# EAGLE design Hall Effect Sensor 63mm (EAGLE 7.2.0)
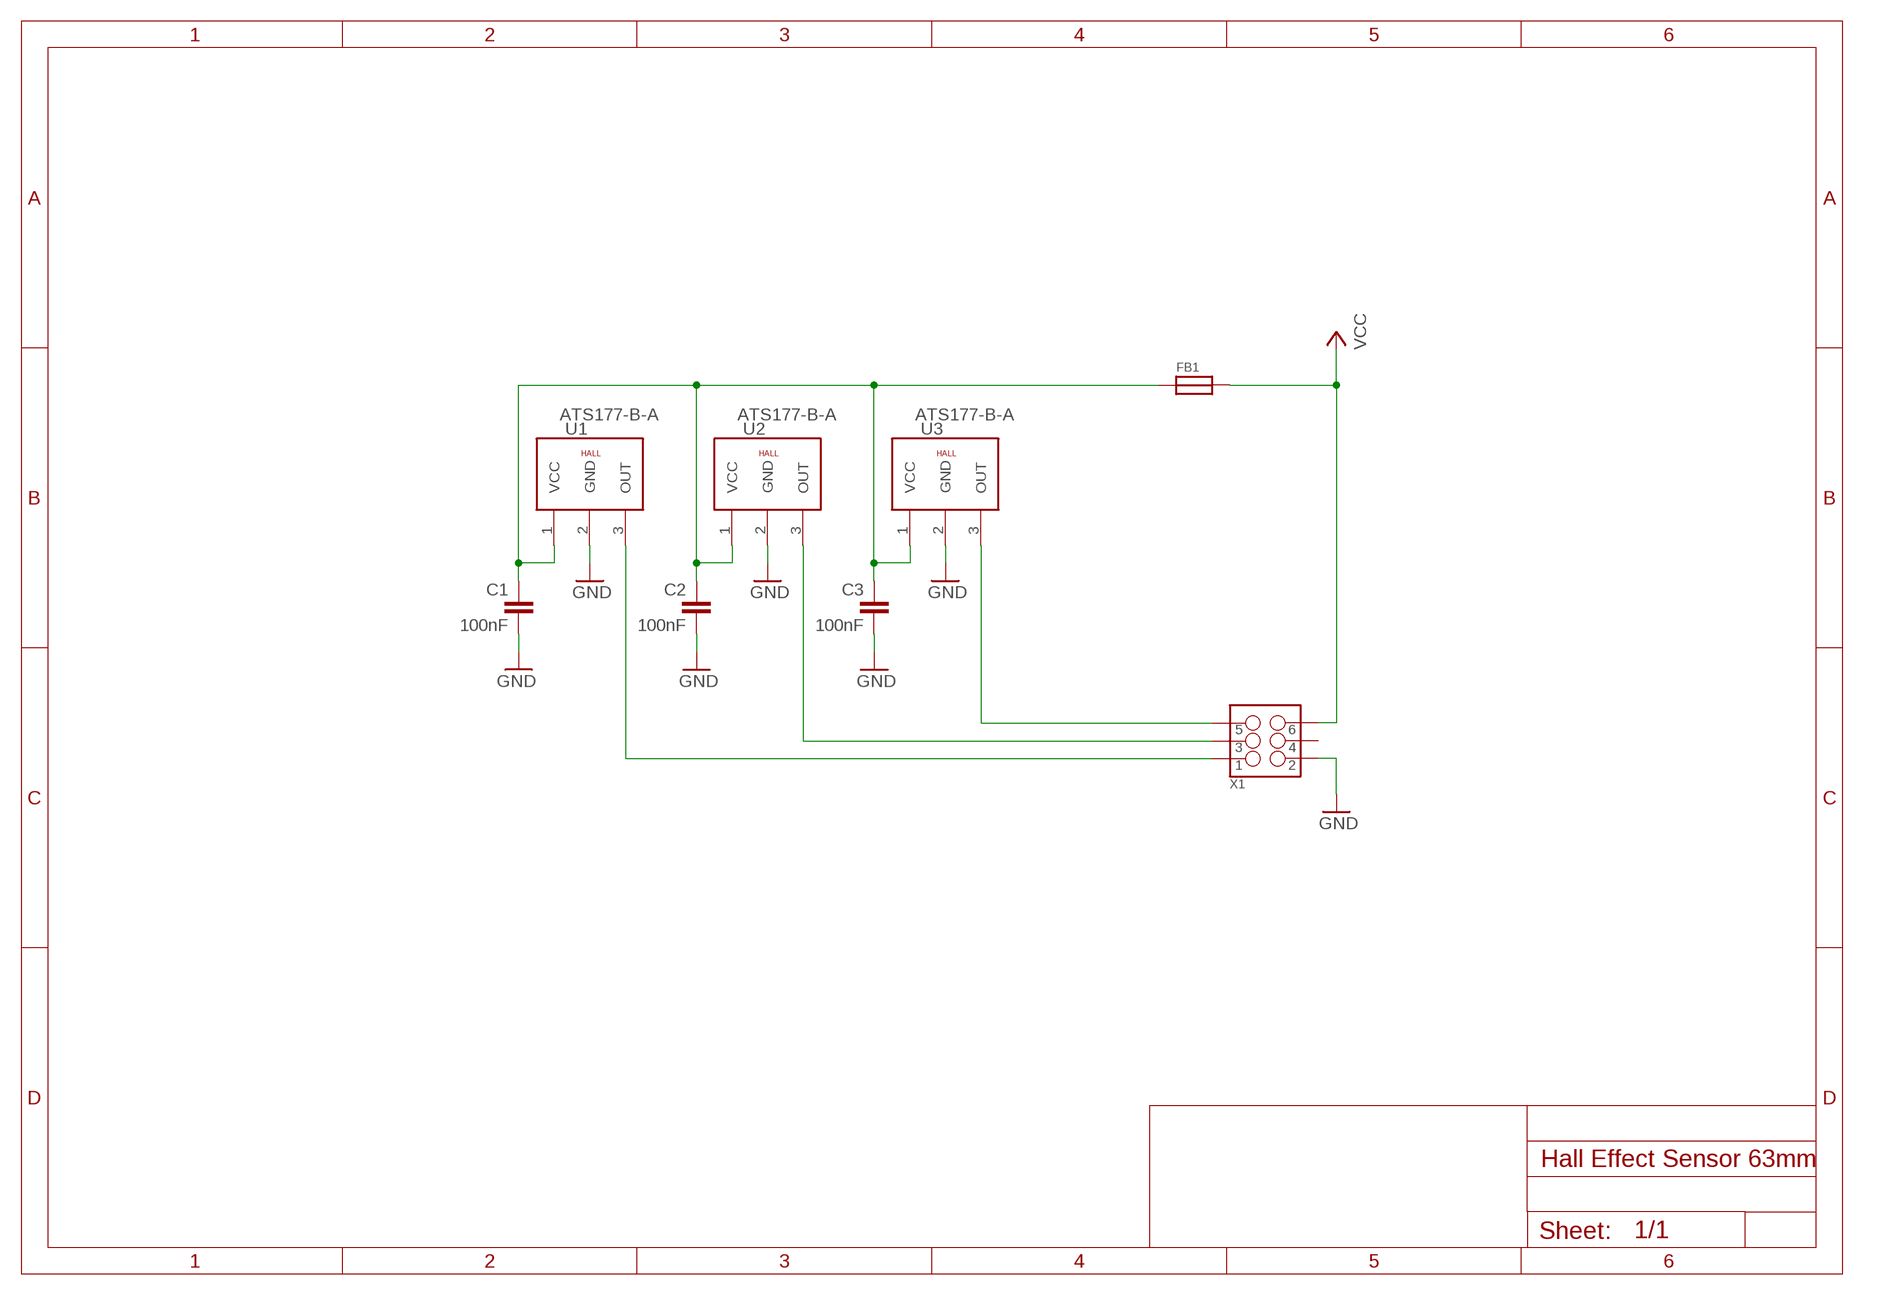
[diagram p0: schematic, sheet 1]

## Parts
C1  100nF  C-EUC0603  [C0603]
C2  100nF  C-EUC0603  [C0603]
C3  100nF  C-EUC0603  [C0603]
FB1  FERRITE  [0603]
U1  ATS177-B-A  HALL3-SIP  [3PINS1,27]
U2  ATS177-B-A  HALL3-SIP  [3PINS1,27]
U3  ATS177-B-A  HALL3-SIP  [3PINS1,27]
X1  M03X2POGO_PINS  [2X3_POGO]

## Nets
GND: C1.2 C2.2 C3.2 U1.2(GND) U2.2(GND) U3.2(GND) X1.P$2
OUT1: U1.3(OUT) X1.P$1
OUT2: U2.3(OUT) X1.P$3
OUT3: U3.3(OUT) X1.P$5
VCC: FB1.2 X1.P$6
VDD: C1.1 C2.1 C3.1 FB1.1 U1.1(VCC) U2.1(VCC) U3.1(VCC)
Unconnected: X1.P$4

## Library data of the parts
C1-C3 = rcl:C-EU: CAPACITOR, European symbol; MF: TDK; MPN: CGA3E2X7R1H104K080AA; OC_FARNELL: 2346967
FB1 = microbuilder:FERRITE: Ferrite Bead 0603 MMZ1608B121C - 120 Ohm, 600mA Ferrite Chip - Digikey: 445-2164-1-ND BK1608HW121-T - 120 Ohm, 600mA Ferrite Chip - Digikey: 587-1876-2-ND; MF: MURATA; MPN: BLM18TG601TN1D; OC_FARNELL: 1115050
U1-U3 = charleses_parts_bin:HALL; MF: ALLEGRO MICROSYSTEMS; MPN: A1221LUA-T; OC_FARNELL: 1791408
X1 = SparkFun-Connectors:M03X2: 2x3 .1" header. Shrouded, with keying- CONN-10681 SMT- CONN-11415 Pogo pins- HW-11044; OC_FARNELL: unknown; PROD_ID: HW-11044

## Board
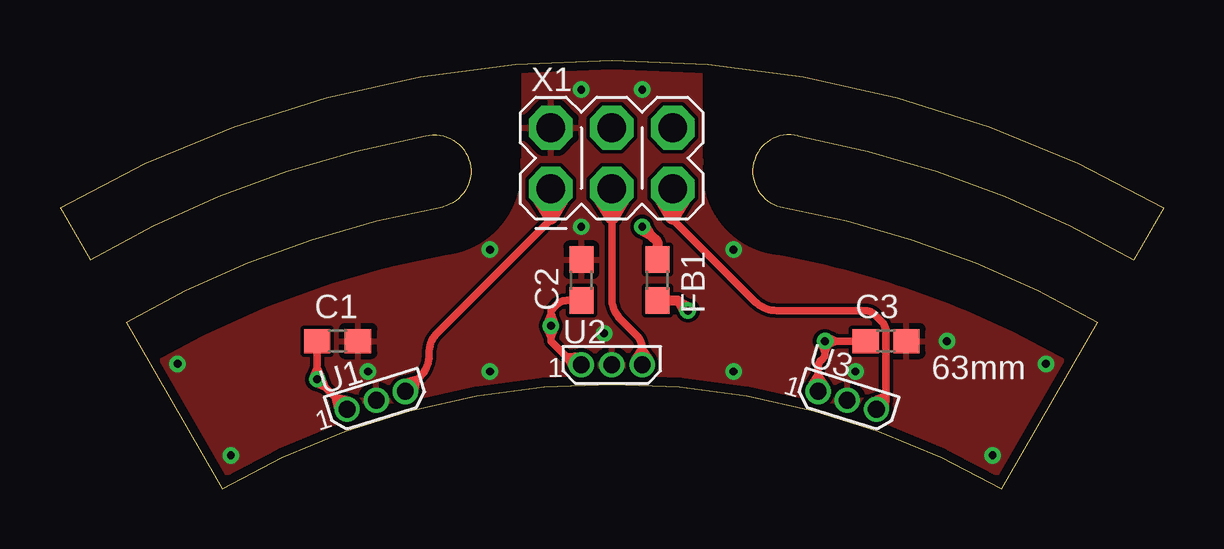
[diagram p1: board, top side]
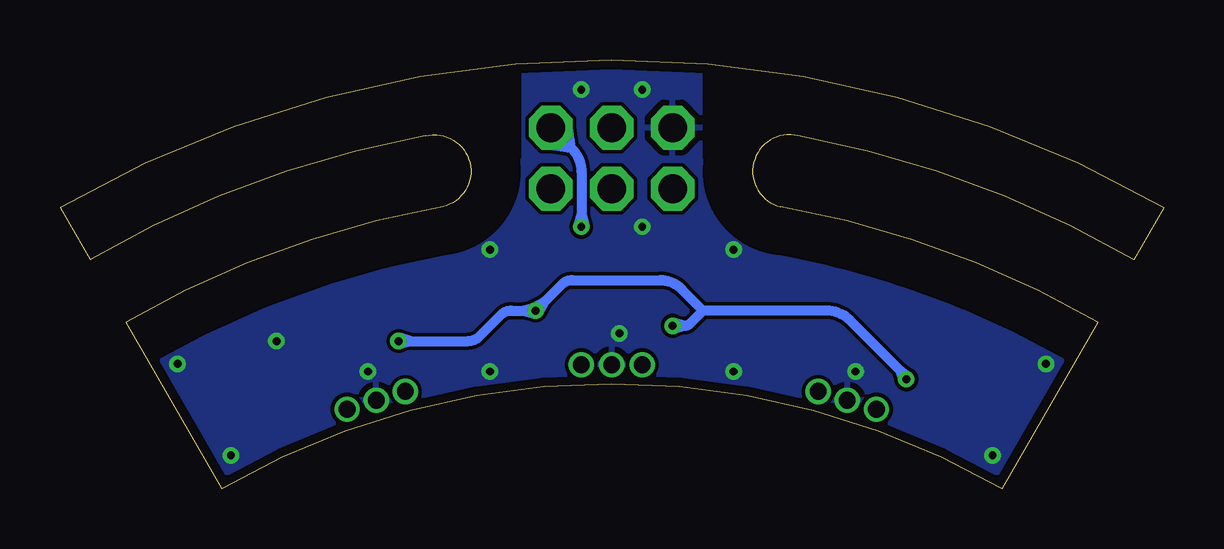
[diagram p2: board, bottom side, seen from below]

Size 46 x 17.85 mm. Coordinates in mm from the lower left corner, seen from the top.
Outline: 6.75,0 arc-60 39.25,0 43.25,6.93 arc20 30.03,11.74 arc-180 30.75,14.69 arc-20 44.75,9.53 46,11.69 arc60 0,11.69 1.25,9.53 arc-20 15.25,14.69 arc-180 15.97,11.74 arc20 2.75,6.93 6.75,0
Copper layers (1*16): Top 0.0356mm / dielectric 1.5011mm / Bottom 0.0356mm
Design rules "OSHPark-2layer": minimum track width 6mil, minimum drill 13mil, track to track 6mil, track to pad 6mil, pad to pad 6mil, via to via 6mil, smd to smd 6mil, copper to edge 15mil, drill to drill 6mil, minimum pad ring 7mil, minimum via ring 7mil, stop-mask expansion 3mil, vias tented up to drill 0mil, thermal gap 10mil
tRestrict: 4 lines
bRestrict: 4 lines

### Footprints (pad centres in the part's own frame; a part is rotated, then mirrored left to right if it is on the bottom)
C0603 = smd 1.1 x 1: 1 -0.85,0; 2 0.85,0
0603 = smd 1.1 x 1: 1 -0.85,0; 2 0.85,0
3PINS1,27 = drill 0.7 pad 1.016: 1 -1.27,0; 2 0,0; 3 1.27,0
2X3_POGO = drill 1.2 pad 1.829 octagon: P$1 0,0; P$2 0,2.54; P$3 2.54,0; P$4 2.54,2.54; P$5 5.08,0; P$6 5.08,2.54

### Placement (x,y rotation side)
C1  11.57,6.14 0 top
C2  21.73,8.68 90 top
C3  34.43,6.14 0 top
FB1  24.91,8.68 90 top
U1  13.18,3.67 17.1 top
U2  23,5.15 0 top
U3  32.82,3.67 342.9 top
X1  20.46,12.49 0 top

### Tracks (layer width: path | path; a pad name or v marks a point on that pad's centre or on a via)
GND  (via drill 0.33)
  other vias: 4.9,5.19 7.12,1.38 38.88,1.38 41.1,5.19 17.92,9.95 21.73,16.62 24.27,16.62 28.08,9.95 17.92,4.87 28.08,4.87 36.97,6.14 33.16,4.87 22.68,6.46 12.84,4.87 21.73,10.91
  pour Top (rank 6): -1.13,18.84 47.13,18.84 47.13,-1.48 -1.13,-1.48
  pour Bottom (rank 6): -1.13,18.84 47.13,18.84 47.13,-1.48 -1.13,-1.48
OUT1
  Top 0.305: X1.P$1 20.46,11.29 20.46,11.22 15.75,6.52 arc45 15.38,5.62 15.38,5.56 arc-45 15,4.66 14.89,4.54 | U1.3 14.89,4.54 | 14.89,4.54 14.32,4.41 U1.3 | 14.89,4.54 14.77,3.97 U1.3
  Top 0.61: 20.46,11.29 20.98,12.18 X1.P$1 19.93,12.18 20.46,11.29
OUT2
  Top 0.305: X1.P$3 23,11.29 23,7.94 arc45 23.37,7.04 24.07,6.35 arc-45 24.27,5.85 | U2.3 24.27,5.85 | 24.27,5.85 23.95,5.36 U2.3 | 24.27,5.85 24.59,5.36 U2.3
  Top 0.61: 23,11.29 23.52,12.18 X1.P$3 22.48,12.18 23,11.29
OUT3
  Top 0.305: X1.P$5 25.54,11.29 25.54,11.22 28.98,7.79 arc45 29.88,7.41 33.53,7.41 arc-45 33.98,7.23 34.24,6.97 arc-45 34.43,6.52 34.43,3.88 | U3.3 34.43,3.7 34.43,3.88 | 34.43,3.88 33.88,3.65 U3.3 | 34.43,3.88 34.4,3.29 U3.3
  Top 0.61: 25.54,11.29 26.07,12.18 X1.P$5 25.02,12.18 25.54,11.29
VCC  (via drill 0.33)
  Top 0.406: v24.27,10.91 24.62,10.56 | 24.62,10.56 24.91,10.27 FB1.2 | 24.62,10.56 24.39,10.97 v24.27,10.91 | 24.62,10.56 24.2,10.78 v24.27,10.91
  Bottom 0.406: X1.P$6 24.69,14.19 | 24.69,14.19 24.64,14.14 arc45 24.27,13.24 24.27,11.4 | 24.27,11.4 v24.27,10.91 | 24.27,11.4 24.14,10.95 v24.27,10.91 | 24.27,11.4 24.4,10.95 v24.27,10.91 | 24.69,14.19 25.65,14.33 X1.P$6 | 24.69,14.19 24.84,15.14 X1.P$6
VDD  (via drill 0.33)
  Top 0.305: C3.1 32.38,6.14 | 32.38,6.14 v31.89,6.14 | U3.1 31.6,4.75 | 31.6,4.75 31.6,5.03 arc-45 31.73,5.35 31.89,5.51 31.89,5.65 | 31.89,5.65 v31.89,6.14 | U2.1 21.45,5.15 21.11,5.49 | 21.11,5.49 20.46,6.14 20.46,6.28 | 20.46,6.28 v20.46,6.78 | v20.46,6.78 20.46,7.27 | 20.46,7.27 20.46,7.41 20.71,7.66 arc-45 21.13,7.83 C2.1 | U1.1 11.48,3.8 | 11.48,3.8 11.07,4.2 | 11.07,4.2 v10.72,4.55 | C1.1 10.72,5.05 | 10.72,5.05 v10.72,4.55 | 32.38,6.14 31.96,6.32 v31.89,6.14 | 32.38,6.14 31.96,5.97 v31.89,6.14 | 31.89,5.65 32.07,6.07 v31.89,6.14 | 31.89,5.65 31.71,6.07 v31.89,6.14 | 20.46,6.28 20.64,6.71 v20.46,6.78 | 20.46,6.28 20.28,6.71 v20.46,6.78 | 20.46,7.27 20.28,6.85 v20.46,6.78 | 20.46,7.27 20.64,6.85 v20.46,6.78 | 11.07,4.2 10.9,4.62 v10.72,4.55 | 11.07,4.2 10.65,4.38 v10.72,4.55 | 10.72,5.05 10.54,4.63 v10.72,4.55 | 10.72,5.05 10.9,4.63 v10.72,4.55 | 11.48,3.8 11.6,3.22 U1.1 | 11.48,3.8 12.05,3.67 U1.1 | 21.11,5.49 21.4,4.97 U2.1 | 21.11,5.49 21.7,5.53 U2.1 | 31.6,4.75 31.29,4.25 U3.1 | 31.6,4.75 31.92,4.25 U3.1
  Top 0.406: FB1.1 25.75,7.83 25.82,7.76 | 25.82,7.76 v26.18,7.41 | 25.82,7.76 26.05,7.35 v26.18,7.41 | 25.82,7.76 26.24,7.54 v26.18,7.41
  Bottom 0.406: v26.18,7.41 25.82,7.76 | 25.82,7.76 25.09,8.5 arc45 24.64,8.68 20.99,8.68 arc45 20.09,8.31 19.19,7.41 | 11.01,4.95 13.06,7 arc-45 14.06,7.41 19.19,7.41 | v31.89,6.14 31.39,6.14 | 31.39,6.14 28.98,6.14 arc-45 28.53,6.33 27.63,7.23 arc45 27.18,7.41 26.67,7.41 | 26.67,7.41 v26.18,7.41 | v20.46,6.78 19.96,6.78 | 19.96,6.78 arc-45 19.73,6.88 19.19,7.41 | v10.72,4.55 10.72,4.66 11.01,4.95 | 31.39,6.14 31.85,6.01 v31.89,6.14 | 31.39,6.14 31.85,6.28 v31.89,6.14 | 25.82,7.76 26.05,7.35 v26.18,7.41 | 25.82,7.76 26.24,7.54 v26.18,7.41 | 26.67,7.41 26.21,7.55 v26.18,7.41 | 26.67,7.41 26.21,7.28 v26.18,7.41 | 19.96,6.78 20.42,6.65 v20.46,6.78 | 19.96,6.78 20.42,6.91 v20.46,6.78 | 11.01,4.95 10.63,4.66 v10.72,4.55 | 11.01,4.95 10.85,4.51 v10.72,4.55

### Text on the board
tNames: 63mm
Document: Sensors placed 120 electrical degrees apart. / 360/(3*7) = 17.1428571429 / 33.3mm from centre. | 32.5mm Inner Diameter / 42.0mm Mounting Diameter / 46.0mm Outer Diameter / 60 degree width / 3mm bolt clearence / 7mm bolt head clearence | Designed by TheFallen / Inspired by Equals Zero Designs